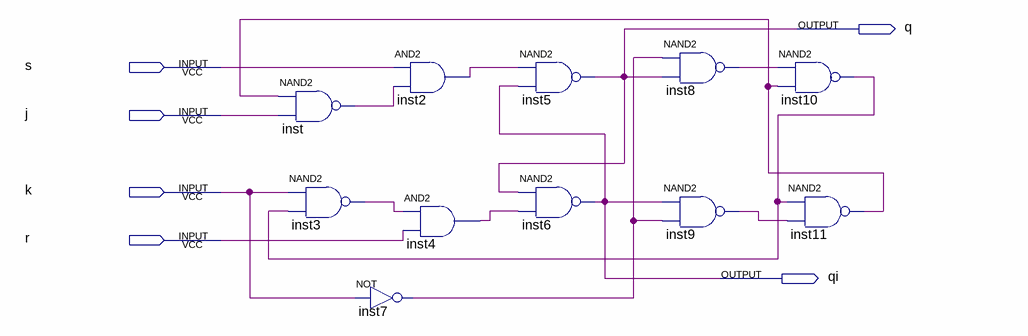
[diagram p0: schematic sheet]
// Quartus schematic p1_jk-rs.bdf as structural Verilog: 11 symbols, 6 pins
module \p1_jk-rs  (
  input  s,
  input  j,
  input  k,
  input  r,
  output q,
  output qi
);

  wire inst2_out, inst3_out, inst4_out, inst7_out, inst8_out, inst9_out, inst10_out, inst11_out, inst_out;

  nand inst (inst_out, inst11_out, j);
  nand inst3 (inst3_out, k, inst10_out);
  and inst2 (inst2_out, s, inst_out);
  and inst4 (inst4_out, inst3_out, r);
  not inst7 (inst7_out, k);
  nand inst5 (q, inst2_out, qi);
  nand inst6 (qi, q, inst4_out);
  nand inst8 (inst8_out, inst7_out, q);
  nand inst9 (inst9_out, qi, inst7_out);
  nand inst10 (inst10_out, inst8_out, inst11_out);
  nand inst11 (inst11_out, inst10_out, inst9_out);
endmodule
